# Altium schematic sheet Display_Port.SchDoc: Display Port (x4)
size B; DocumentNumber: 5; SheetNumber: 5; SheetTotal: 46
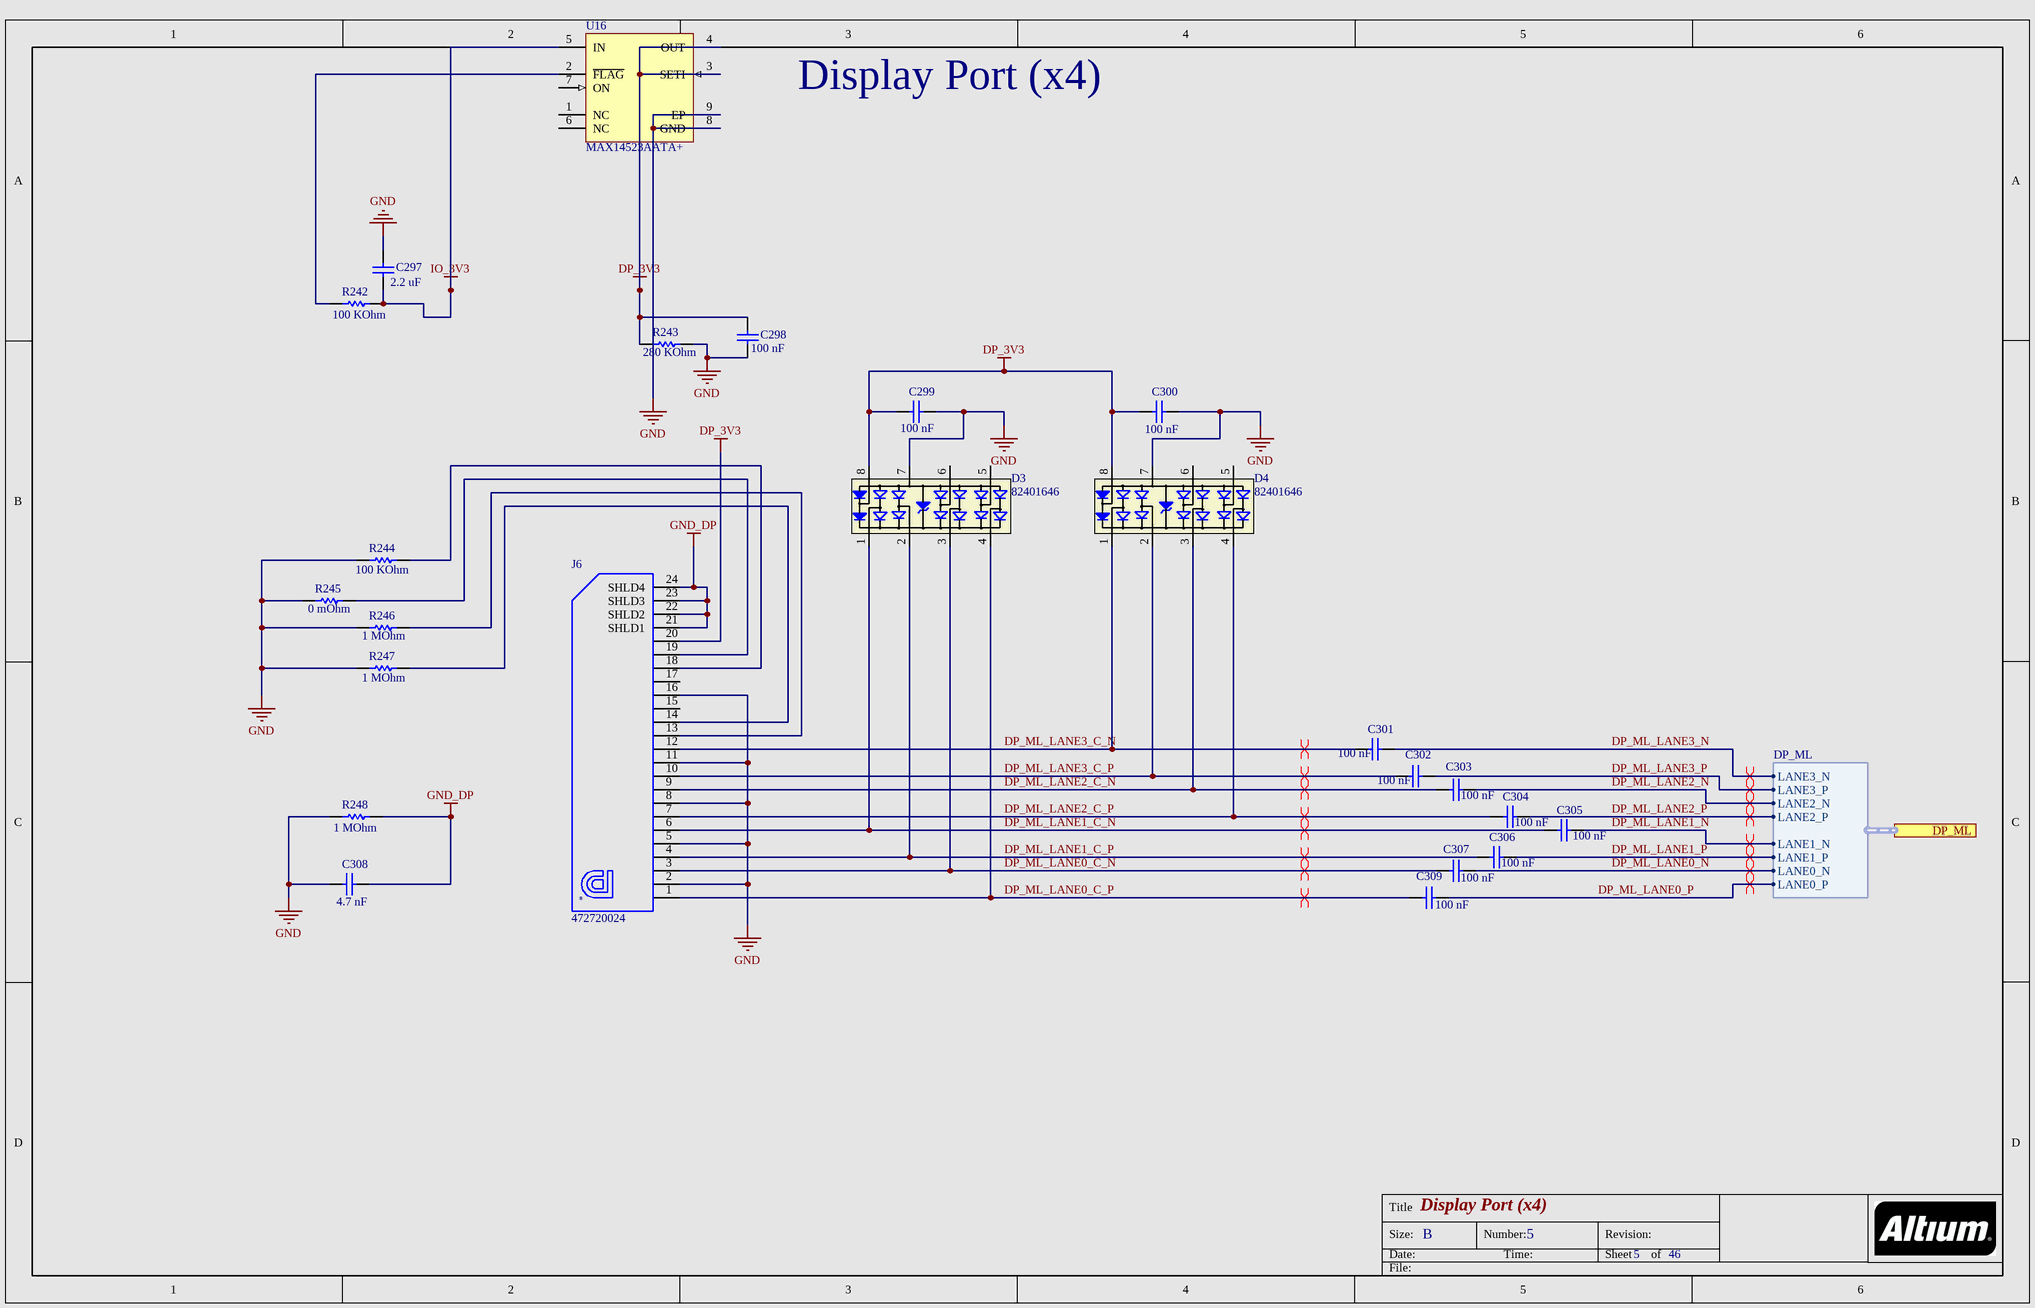
[diagram p0: Display_Port.SchDoc]

## Parts
C297  Capacitance: 2.2 uF  [CAPC1608X90X35ML10T15]  (hidden comment: GRM188R61A225KE34x)
C298  Capacitance: 100 nF  [CAPC1005X55X10LL05]  (hidden comment: C1005X7R1E104M)
C299  Capacitance: 100 nF  [CAPC1005X55X10LL05]  (hidden comment: C1005X7R1E104M)
C300  Capacitance: 100 nF  [CAPC1005X55X10LL05]  (hidden comment: C1005X7R1E104M)
C301  Capacitance: 100 nF  [CAPC1005X55X10LL05]  (hidden comment: C1005X7R1E104M)
C302  Capacitance: 100 nF  [CAPC1005X55X10LL05]  (hidden comment: C1005X7R1E104M)
C303  Capacitance: 100 nF  [CAPC1005X55X10LL05]  (hidden comment: C1005X7R1E104M)
C304  Capacitance: 100 nF  [CAPC1005X55X10LL05]  (hidden comment: C1005X7R1E104M)
C305  Capacitance: 100 nF  [CAPC1005X55X10LL05]  (hidden comment: C1005X7R1E104M)
C306  Capacitance: 100 nF  [CAPC1005X55X10LL05]  (hidden comment: C1005X7R1E104M)
C307  Capacitance: 100 nF  [CAPC1005X55X10LL05]  (hidden comment: C1005X7R1E104M)
C308  Capacitance: 4.7 nF  [CAPC1005X55X25NL05T10]  (hidden comment: GRM155R71H472KA01D)
C309  Capacitance: 100 nF  [CAPC1005X55X10LL05]  (hidden comment: C1005X7R1E104M)
D3  82401646  [MSOP-8L]
D4  82401646  [MSOP-8L]
J6  472720024  [MOLX-472720024_V]
R242  Resistance: 100 KOhm  [RESC1005X40X25LL05T05]  (hidden comment: ERJ-2RKF1003X)
R243  Resistance: 280 KOhm  [RESC1005X40X25LL05T05]  (hidden comment: ERJ-2RKF2803X)
R244  Resistance: 100 KOhm  [RESC1005X40X25LL05T05]  (hidden comment: ERJ-2RKF1003X)
R245  Resistance: 0 mOhm  [RESC1005X40X25ML05T05]  (hidden comment: ERJ-2GE0R00X)
R246  Resistance: 1 MOhm  [RESC1005X40X25LL05T05]  (hidden comment: ERJ-2RKF1004X)
R247  Resistance: 1 MOhm  [RESC1005X40X25LL05T05]  (hidden comment: ERJ-2RKF1004X)
R248  Resistance: 1 MOhm  [RESC1005X40X25LL05T05]  (hidden comment: ERJ-2RKF1004X)
U16  MAX14523AATA+  [MAXM-T833+2_V]

## Ports
DP_ML (harness DP_ML)

## Harnesses
DP_ML: LANE2_P, LANE2_N, LANE3_P, LANE3_N, LANE1_N, LANE1_P, LANE0_N, LANE0_P

## Nets
DP_3V3: C298.2 C299.2 C300.2 D3.8(VDD) D4.8(VDD) J6.20 R243.1 U16.3(SETI) U16.4(OUT)
GND: C297.2 C298.1 C299.1 C300.1 C308.1 D3.7(GND) D4.7(GND) J6.2 J6.5 J6.8 J6.11 J6.16 R243.2 R244.1 R245.1 R246.1 R247.1 R248.1 U16.8(GND) U16.9(EP)
GND_DP: C308.2 J6.21(SHLD1) J6.22(SHLD2) J6.23(SHLD3) J6.24(SHLD4) R248.2
IO_3V3: C297.1 R242.2 U16.5(IN)
DP_ML_LANE0_C_N: C307.2 D3.3(I/O3) J6.3
DP_ML_LANE0_C_P: C309.2 D3.4(I/O4) J6.1
DP_ML_LANE0_N: C307.1 ; port DP_ML.LANE0_N
DP_ML_LANE0_P: C309.1 ; port DP_ML.LANE0_P
DP_ML_LANE1_C_N: C305.2 D3.1(I/O1) J6.6
DP_ML_LANE1_C_P: C306.2 D3.2(I/O2) J6.4
DP_ML_LANE1_N: C305.1 ; port DP_ML.LANE1_N
DP_ML_LANE1_P: C306.1 ; port DP_ML.LANE1_P
DP_ML_LANE2_C_N: C303.2 D4.3(I/O3) J6.9
DP_ML_LANE2_C_P: C304.2 D4.4(I/O4) J6.7
DP_ML_LANE2_N: C303.1 ; port DP_ML.LANE2_N
DP_ML_LANE2_P: C304.1 ; port DP_ML.LANE2_P
DP_ML_LANE3_C_N: C301.2 D4.1(I/O1) J6.12
DP_ML_LANE3_C_P: C302.2 D4.2(I/O2) J6.10
DP_ML_LANE3_N: C301.1 ; port DP_ML.LANE3_N
DP_ML_LANE3_P: C302.1 ; port DP_ML.LANE3_P
NetJ6_13: J6.13 R246.2
NetJ6_14: J6.14 R247.2
NetJ6_18: J6.18 R244.2
NetJ6_19: J6.19 R245.2
NetR242_1: R242.1 U16.2(~{FLAG})

Not connected (* = marked no-connect by the designer): D3 5(I/O5) 6(I/O6); D4 5(I/O5) 6(I/O6); J6 15 17; U16 1(NC) 6(NC) 7(ON)

## Layout directives
differential pair: DP_ML_LANE0_C_N, DP_ML_LANE0_C_P, DP_ML_LANE0_N, DP_ML_LANE0_P, DP_ML_LANE1_C_N, DP_ML_LANE1_C_P, DP_ML_LANE1_N, DP_ML_LANE1_P, DP_ML_LANE2_C_N, DP_ML_LANE2_C_P, DP_ML_LANE2_N, DP_ML_LANE2_P, DP_ML_LANE3_C_N, DP_ML_LANE3_C_P, DP_ML_LANE3_N, DP_ML_LANE3_P

## Notes on the sheet
- Title
- Size:
- Date:
- B
- Number:
- Time:
- Revision:
- Sheet
- of
- File:
- (in symbol CMP-1704-00002-1) ®

## Library data of the parts
C297 = CMP-1662-00016-2: Chip Capacitor, 2.2 uF, +/- 10%, 10 V, -55 to 85 degC, 0603 (1608 Metric), RoHS, Tape and Reel; Tolerance: 10%; Width: 0.031 inch; DatasheetVersion: 01/2013; Case/Package: 0603; Length: 0.063 inch; PartNumber: GRM188R61A225KE34x; Package Quantity: 10000; Case Code (Imperial): 0603; Packaging: Tape and Reel; PackageDescription: 2-Pin Surface Mount Device, Body 1.6 x 0.8 mm; Case Code (Metric): 1608; ComponentLink1Description: Manufacturer URL; Radiation Hardening: No; Mounting Technology: Surface Mount; Height: 0.8 mm; RoHSCompliant: True; ComponentLink2URL: https://datasheet.ciiva.com/134/grm188r61a225ke34-01-134206.pdf; ComponentLink2Description: Datasheet; Max Operating Temperature: 85 degC; Min Operating Temperature: -55 degC; ComponentLink1URL: http://www.murata.com/
C298-C307 C309 = CMP-1663-00009-2: Chip Capacitor, 0.1 uF, +/- 20%, 25 V, -55 to 125 degC, 0402 (1005 Metric), RoHS, Tape and Reel; Type (Capacitors): X7R; Voltage Rating: 25 V; Case\/Package: 0402; Tolerance: 20%; Max Operating Temperature: 125 degC; ComponentLink2URL: http://www.farnell.com/datasheets/1571323.pdf; ComponentLink1URL: http://www.tdk.com/; RoHSCompliant: true; Packaging: Tape and Reel; Mounting Technology: Surface Mount; ComponentLink2Description: Datasheet; Case Code (Imperial): 0402; DatasheetVersion: 09/2011; ComponentLink1Description: Manufacturer URL; PackageDescription: 2-Pin Surface Mount Device, Body 1 x 0.5 mm; PackageReference: 0402; Min Operating Temperature: -55 degC; Case Code (Metric): 1005; Height: 0.5 mm; Package Quantity: 10000; Width: 0.5 mm; Pins: 2; Voltage Rating (DC): 25 V; PartNumber: C1005X7R1E104M; Mount: Surface Mount; Length: 1 mm
C308 = CMP-2008-04663-4: Chip Capacitor, 4.7 nF, +/- 10%, 50 V, -55 to 125 degC, 0402 (1005 Metric), RoHS, Tape and Reel; Manufacturer: Basic Passives; Voltage Rating: 50 V; Case\/Package: 0402; Type (Capacitors): X7R; Case Code (Metric): 1005; Case Code (Imperial): 0402; RoHSCompliant: true; Length: 1 mm; PartNumber: GRM155R71H472KA01D; Width: 0.5 mm; PackageDescription: 2-Pin Surface Mount Device, Body 1 x 0.5 mm; ComponentLink1URL: http://www.murata.com/; Package Quantity: 1; Packaging: Cut Tape; Tolerance: 10%; Height: 0.5 mm; Max Operating Temperature: 125 degC; ComponentLink1Description: Manufacturer URL; Min Operating Temperature: -55 degC; REACH SVHC: No SVHC; Mounting Technology: Surface Mount; ComponentLink2URL: http://search.murata.co.jp/Ceramy/image/img/A01X/G101/ENG/GRM155R71H472KA01-01.pdf; Mount: Surface Mount; Voltage Rating (DC): 50 V; PackageReference: 0402; DatasheetVersion: 02/2016; Radiation Hardening: No; Pins: 2; Lead Pitch: 2 mm; ComponentLink2Description: Datasheet
D3 D4 = CMP-1482-00002-1: TVS Diode WE-TVS-SS, VRWM=5V; Manufacturer: Wuerth Elektronik; Reverse Stand Off Voltage: 5V; ComponentLink1URL: http://www.we-online.com; PartNumber: 82401646; ComponentLink2Description: Datasheet; PackageReference: MSOP-8L; ComponentLink1Description: Manufacturer URL; ComponentLink2URL: http://katalog.we-online.de/kataloge/eisos/media/pdf/82401646.pdf
J6 = CMP-1704-00002-1: DisplayPort Connector, Pitch 0.5 mm, 1 x 20 Position, Height 6.65 mm, -20 to 85 degC, RoHS, Tape and Reel; Manufacturer: Molex; ComponentLink2URL: http://www.molex.com/pdm_docs/sd/472720024_sd.pdf; PackageReference: 472720024; ComponentLink2Description: Datasheet; DatasheetVersion: Rev. F; PackageDescription: DisplayPort Connector, Pitch 0.5 mm, 1 x 20 Position, Height 6.65 mm; ComponentLink1URL: http://www.molex.com/; Mounting Technology: Surface Mount; PartNumber: 472720024; ComponentLink1Description: Manufacturer URL
R242 R244 = CMP-2002-00608-3: Chip Resistor, 100 KOhm, +/- 1%, 100 mW, -55 to 155 degC, 0402 (1005 Metric), RoHS, Tape and Reel; Manufacturer: Basic Passives; Voltage Rating: 50 V; Power Rating: 100 mW; Case\/Package: 0402; Height: 0.35 mm; ComponentLink1Description: Manufacturer URL; Packaging: Tape and Reel; Min Operating Temperature: -55 degC; RoHSCompliant: true; PackageDescription: 2-Pin Surface Mount Device, Body 1 x 0.5 mm; Mount: Surface Mount; Package Quantity: 10000; Max Operating Temperature: 155 degC; ComponentLink1URL: http://www.panasonic.com/; Tolerance: 1%; Mounting Technology: Surface Mount; PartNumber: ERJ-2RKF1003X; Case Code (Metric): 1005; Case Code (Imperial): 0402; REACH SVHC: Yes; Length: 1 mm; Width: 0.5 mm; DatasheetVersion: 04/2015; Pins: 2; ComponentLink2Description: Datasheet; ComponentLink2URL: http://industrial.panasonic.com/cdbs/www-data/pdf/RDA0000/AOA0000C86.pdf; PackageReference: 0402; Radiation Hardening: No
R243 = CMP-2002-00835-3: Chip Resistor, 280 KOhm, +/- 1%, 100 mW, -55 to 155 degC, 0402 (1005 Metric), RoHS, Cut Tape; Manufacturer: Basic Passives; Power Rating: 100 mW; Voltage Rating: 50 V; Case\/Package: 0402; Mount: Surface Mount; Width: 0.02 inch; Max Operating Temperature: 155 degC; REACH SVHC: Yes; Min Operating Temperature: -55 degC; PartNumber: ERJ-2RKF2803X; Mounting Technology: Surface Mount; ComponentLink1URL: http://www.panasonic.com/; Packaging: Cut Tape; Case Code (Imperial): 0402; ComponentLink1Description: Manufacturer URL; Tolerance: 1%; PackageDescription: 2-Pin Surface Mount Device, Body 1 x 0.5 mm; Package Quantity: 10000; Height: 0.016 inch; Length: 0.039 inch; Case Code (Metric): 1005; RoHSCompliant: true; ComponentLink2Description: Datasheet; PackageReference: 0402; ComponentLink2URL: http://industrial.panasonic.com/cdbs/www-data/pdf/RDA0000/AOA0000C86.pdf; Pins: 2; DatasheetVersion: 04/2015
R245 = CMP-2002-00429-3: Chip Resistor, 0 mOhm, +/- 5%, 100 mW, -55 to 155 degC, 0402 (1005 Metric), RoHS, Tape and Reel; Manufacturer: Basic Passives; Power Rating: 100 mW; Voltage Rating: 50 V; Case\/Package: 0402; Max Operating Temperature: 155 degC; Tolerance: 5%; PartNumber: ERJ-2GE0R00X; Case Code (Imperial): 0402; Package Quantity: 10000; Length: 1 mm; Mounting Technology: Surface Mount; ComponentLink1URL: http://www.panasonic.com/; Height: 0.35 mm; Width: 0.5 mm; Min Operating Temperature: -55 degC; Case Code (Metric): 1005; RoHSCompliant: true; REACH SVHC: Unknown; ComponentLink1Description: Manufacturer URL; Packaging: Tape and Reel; Mount: Surface Mount; PackageDescription: 2-Pin Surface Mount Device, Body 1 x 0.5 mm; PackageReference: 0402; ComponentLink2URL: http://industrial.panasonic.com/cdbs/www-data/pdf/RDA0000/AOA0000C84.pdf; DatasheetVersion: 03/2015; Radiation Hardening: No; Pins: 2; ComponentLink2Description: Datasheet
R246-R248 = CMP-2002-00609-3: Chip Resistor, 1 MOhm, +/- 1%, 100 mW, -55 to 155 degC, 0402 (1005 Metric), RoHS, Tape and Reel; Manufacturer: Basic Passives; Power Rating: 100 mW; Voltage Rating: 50 V; Case\/Package: 0402; Mount: Surface Mount; PartNumber: ERJ-2RKF1004X; Height: 0.35 mm; PackageDescription: 2-Pin Surface Mount Device, Body 1 x 0.5 mm; Max Operating Temperature: 155 degC; Mounting Technology: Surface Mount; Case Code (Metric): 1005; REACH SVHC: Yes; Length: 1 mm; ComponentLink1URL: http://www.panasonic.com/; Min Operating Temperature: -55 degC; Width: 0.5 mm; Tolerance: 1%; Package Quantity: 10000; ComponentLink1Description: Manufacturer URL; RoHSCompliant: true; Packaging: Tape and Reel; Case Code (Imperial): 0402; Pins: 2; ComponentLink2URL: http://industrial.panasonic.com/cdbs/www-data/pdf/RDA0000/AOA0000C86.pdf; Weight: 2.8E-05oz; Radiation Hardening: No; ComponentLink2Description: Datasheet; DatasheetVersion: 04/2015; PackageReference: 0402
U16 = CMP-0247-00012-3: Adjustable Current-Limit Switch, 1.7 to 5.5 V, -40 to 125 degC, 8-Pin TDFN (T833+2), RoHS; Manufacturer: Maxim; ILIM: 0.25 to 1.5 A; RON: 70 mOhm Typ.; IQ: 170 uA Typ.; VIH: 1.6 V Min.; VIL: 0.4 V Max.; PartNumber: MAX14523AATA+; Operating Temperature: -40 to 125 degC; Mounting Technology: Surface Mount; VIN: 1.7 to 5.5 V; ComponentLink3Description: Package Specification; ComponentLink2URL: http://datasheets.maximintegrated.com/en/ds/MAX14523A-MAX14523C.pdf; PackageVersion: Mar-14; ComponentLink1URL: http://www.maximintegrated.com/; ComponentLink3URL: http://pdfserv.maximintegrated.com/package_dwgs/21-0137.PDF; ComponentLink1Description: Manufacturer URL; RoHS: TRUE; PackageDescription: 8-Pin SON, Body 3 x 3 mm, Pitch 0.65 mm; ComponentLink2Description: Datasheet; DatasheetVersion: Rev. 1